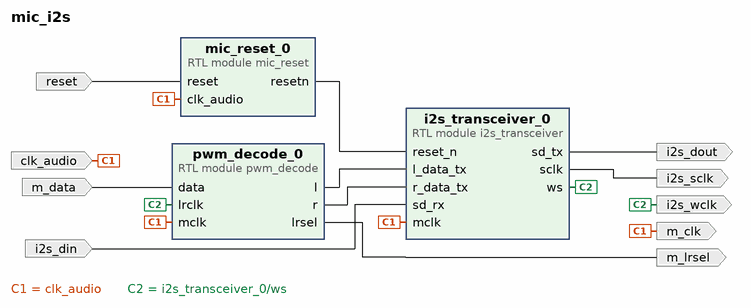
[diagram p0: block diagram of the top level]
# Vivado block design mic_i2s, xc7a100tcsg324-1, Vivado 2021.2
create_bd_design mic_i2s

create_bd_port -dir O m_lrsel
create_bd_port -dir O m_clk
create_bd_port -dir I m_data
create_bd_port -dir O i2s_sclk
create_bd_port -dir O i2s_wclk
create_bd_port -dir O i2s_dout
create_bd_port -dir I -type rst reset
set_property -dict {CONFIG.POLARITY ACTIVE_HIGH} [get_bd_ports reset]
create_bd_port -dir I -type clk clk_audio
set_property -dict {CONFIG.FREQ_HZ 22580650} [get_bd_ports clk_audio]
create_bd_port -dir I i2s_din

create_bd_cell -type module -reference i2s_transceiver i2s_transceiver_0
set_property -dict {CONFIG.d_width 8 CONFIG.mclk_sclk_ratio 8} [get_bd_cells i2s_transceiver_0]
create_bd_cell -type module -reference pwm_decode pwm_decode_0
create_bd_cell -type module -reference mic_reset mic_reset_0

# ---- connections ----

connect_bd_net [get_bd_ports clk_audio] \
  [get_bd_pins i2s_transceiver_0/mclk] [get_bd_ports m_clk] [get_bd_pins pwm_decode_0/mclk] \
  [get_bd_pins mic_reset_0/clk_audio]
connect_bd_net [get_bd_ports i2s_din] [get_bd_pins i2s_transceiver_0/sd_rx]
connect_bd_net [get_bd_pins i2s_transceiver_0/sclk] [get_bd_ports i2s_sclk]
connect_bd_net [get_bd_pins i2s_transceiver_0/sd_tx] [get_bd_ports i2s_dout]
connect_bd_net [get_bd_pins i2s_transceiver_0/ws] [get_bd_ports i2s_wclk] [get_bd_pins pwm_decode_0/lrclk]
connect_bd_net [get_bd_ports m_data] [get_bd_pins pwm_decode_0/data]
connect_bd_net [get_bd_pins pwm_decode_0/l] [get_bd_pins i2s_transceiver_0/l_data_tx]
connect_bd_net [get_bd_pins pwm_decode_0/lrsel] [get_bd_ports m_lrsel]
connect_bd_net [get_bd_pins pwm_decode_0/r] [get_bd_pins i2s_transceiver_0/r_data_tx]
connect_bd_net [get_bd_ports reset] [get_bd_pins mic_reset_0/reset]
connect_bd_net -net util_vector_logic_0_Res [get_bd_pins mic_reset_0/resetn] [get_bd_pins i2s_transceiver_0/reset_n]

validate_bd_design
save_bd_design
